# Altium schematic sheet Top_level.SchDoc
size A
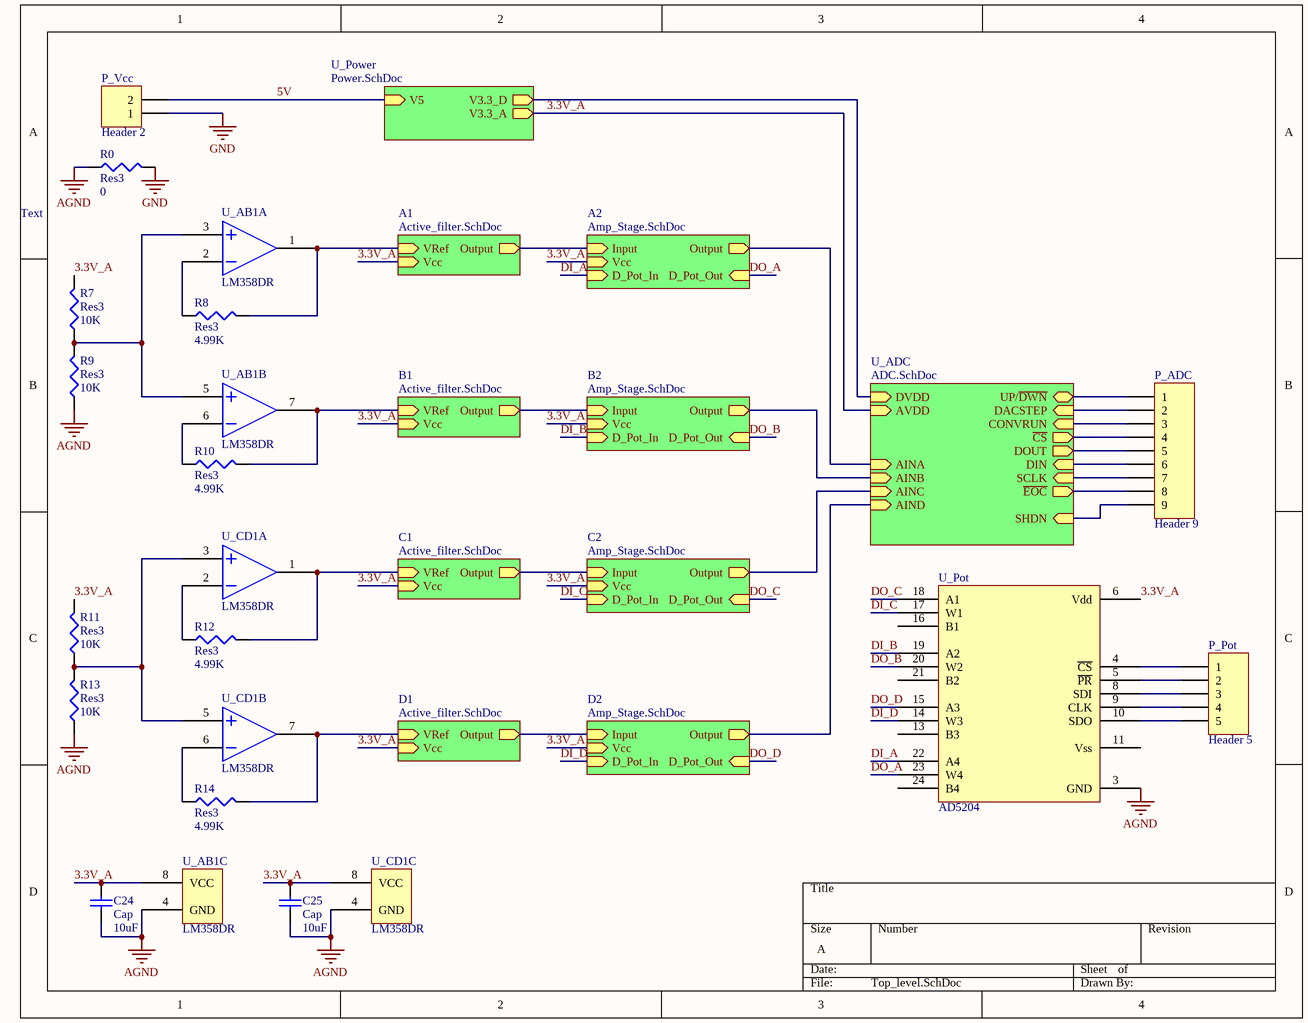
[diagram p0: Top_level.SchDoc]

## Parts
C24  Cap  value 10uF  [1608[0603]]
C25  Cap  value 10uF  [1608[0603]]
P_ADC  Header 9  [HDR1X9]
P_Pot  Header 5  [HDR1X5]
P_Vcc  Header 2  [HDR1X2]
R0  Res3  value 0  [J1-0603]
R7  Res3  value 10K  [J1-0603]
R8  Res3  value 4.99K  [J1-0603]
R9  Res3  value 10K  [J1-0603]
R10  Res3  value 4.99K  [J1-0603]
R11  Res3  value 10K  [J1-0603]
R12  Res3  value 4.99K  [J1-0603]
R13  Res3  value 10K  [J1-0603]
R14  Res3  value 4.99K  [J1-0603]
U_AB1  LM358DR  [SOIC127P600X175-8N(lm358)]  (parts A,B,C of 3)
U_CD1  LM358DR  [SOIC127P600X175-8N(lm358)]  (parts A,B,C of 3)
U_Pot  AD5204  [SOIC127P1030X265-24N(AD5204)]

## Sub-sheets
A1 = Active_filter.SchDoc: Output (out), Vcc (in), VRef (in)
A2 = Amp_Stage.SchDoc: D_Pot_In (in), D_Pot_Out (in), Input (in), Vcc (in), Output (out)
B1 = Active_filter.SchDoc: Output (out), Vcc (in), VRef (in)
B2 = Amp_Stage.SchDoc: Input (in), Output (out), Vcc (in), D_Pot_In (in), D_Pot_Out (in)
C1 = Active_filter.SchDoc: Output (out), Vcc (in), VRef (in)
C2 = Amp_Stage.SchDoc: Input (in), Output (out), Vcc (in), D_Pot_In (in), D_Pot_Out (in)
D1 = Active_filter.SchDoc: Output (out), Vcc (in), VRef (in)
D2 = Amp_Stage.SchDoc: Input (in), Output (out), Vcc (in), D_Pot_In (in), D_Pot_Out (in)
U_ADC = ADC.SchDoc: SHDN (in), SCLK (in), DIN (in), DOUT (out), ~{CS} (out), CONVRUN (in), UP/~{DWN}, ~{EOC} (out), DACSTEP (in), AINC (in), AINA (in), DVDD (in), AINB (in), AIND (in), AVDD (in)
U_Power = Power.SchDoc: V5 (in), V3.3_A (out), V3.3_D (out)

## Nets
AGND: C24.1 C25.1 R0.1 R9.1 R13.1 U_AB1.4(GND) U_CD1.4(GND) U_Pot.3(GND)
GND: P_Vcc.1 R0.2
3.3V_A: C24.2 C25.2 R7.2 R11.2 U_AB1.8(VCC) U_CD1.8(VCC) U_Pot.6(Vdd) ; sheet U_ADC/AVDD, sheet U_Power/V3.3_A, sheet A1/Vcc, sheet B1/Vcc, sheet C1/Vcc, sheet D1/Vcc, sheet A2/Vcc, sheet B2/Vcc, sheet C2/Vcc, sheet D2/Vcc
5V: P_Vcc.2 ; sheet U_Power/V5
DI_A: U_Pot.22(A4) ; sheet A2/D_Pot_In
DI_B: U_Pot.19(A2) ; sheet B2/D_Pot_In
DI_C: U_Pot.17(W1) ; sheet C2/D_Pot_In
DI_D: U_Pot.14(W3) ; sheet D2/D_Pot_In
DO_A: U_Pot.23(W4) ; sheet A2/D_Pot_Out
DO_B: U_Pot.20(W2) ; sheet B2/D_Pot_Out
DO_C: U_Pot.18(A1) ; sheet C2/D_Pot_Out
DO_D: U_Pot.15(A3) ; sheet D2/D_Pot_Out
NetP_ADC_1: P_ADC.1 ; sheet U_ADC/UP/~{DWN}
NetP_ADC_2: P_ADC.2 ; sheet U_ADC/DACSTEP
NetP_ADC_3: P_ADC.3 ; sheet U_ADC/CONVRUN
NetP_ADC_4: P_ADC.4 ; sheet U_ADC/~{CS}
NetP_ADC_5: P_ADC.5 ; sheet U_ADC/DOUT
NetP_ADC_6: P_ADC.6 ; sheet U_ADC/DIN
NetP_ADC_7: P_ADC.7 ; sheet U_ADC/SCLK
NetP_ADC_8: P_ADC.8 ; sheet U_ADC/~{EOC}
NetP_ADC_9: P_ADC.9 ; sheet U_ADC/SHDN
NetP_Pot_1: P_Pot.1 U_Pot.4(~{CS})
NetP_Pot_2: P_Pot.2 U_Pot.5(~{PR})
NetP_Pot_3: P_Pot.3 U_Pot.8(SDI)
NetP_Pot_4: P_Pot.4 U_Pot.9(CLK)
NetP_Pot_5: P_Pot.5 U_Pot.10(SDO)
NetR7_1: R7.1 R9.2 U_AB1.3(1IN+) U_AB1.5(2IN+)
NetR8_1: R8.1 U_AB1.2(1IN-)
NetR8_2: R8.2 U_AB1.1(1OUT) ; sheet A1/VRef
NetR10_1: R10.1 U_AB1.6(2IN-)
NetR10_2: R10.2 U_AB1.7(2OUT) ; sheet B1/VRef
NetR11_1: R11.1 R13.2 U_CD1.3(1IN+) U_CD1.5(2IN+)
NetR12_1: R12.1 U_CD1.2(1IN-)
NetR12_2: R12.2 U_CD1.1(1OUT) ; sheet C1/VRef
NetR14_1: R14.1 U_CD1.6(2IN-)
NetR14_2: R14.2 U_CD1.7(2OUT) ; sheet D1/VRef
(unnamed): sheet U_ADC/AINC, sheet C2/Output
(unnamed): sheet U_ADC/AINA, sheet A2/Output
(unnamed): sheet U_ADC/DVDD, sheet U_Power/V3.3_D
(unnamed): sheet U_ADC/AINB, sheet B2/Output
(unnamed): sheet U_ADC/AIND, sheet D2/Output
(unnamed): sheet A1/Output, sheet A2/Input
(unnamed): sheet B1/Output, sheet B2/Input
(unnamed): sheet C1/Output, sheet C2/Input
(unnamed): sheet D1/Output, sheet D2/Input

Not connected (* = marked no-connect by the designer): U_Pot 11(Vss) 13(B3) 16(B1) 21(B2) 24(B4)

## Notes on the sheet
- Text

## Library data of the parts
C24 C25 = Cap: Capacitor; Published: 8-Jun-2000; LatestRevisionDate: 17-Jul-2002; LatestRevisionNote: Re-released for DXP Platform.; PackageReference: RAD-0.3; Publisher: Altium Limited; PackageDescription: Radial Cap, Thru-Hole; 2 Leads; 0.3 in Pin Spacing
P_ADC = Header 9: Header, 9-Pin; LatestRevisionDate: 17-Jul-2002; LatestRevisionNote: Re-released for DXP Platform.; Publisher: Altium Limited
P_Pot = Header 5: Header, 5-Pin; LatestRevisionDate: 17-Jul-2002; LatestRevisionNote: Re-released for DXP Platform.; Publisher: Altium Limited
P_Vcc = Header 2: Header, 2-Pin; LatestRevisionDate: 17-Jul-2002; LatestRevisionNote: Re-released for DXP Platform.; Publisher: Altium Limited
R0 R7-R14 = Res3: Resistor; Published: 8-Jun-2000; LatestRevisionDate: 29-May-2009; LatestRevisionNote: IPC-7351 Footprint Added.; PackageReference: J1-0603; Publisher: Altium Limited; PackageDescription: Chip Resistor